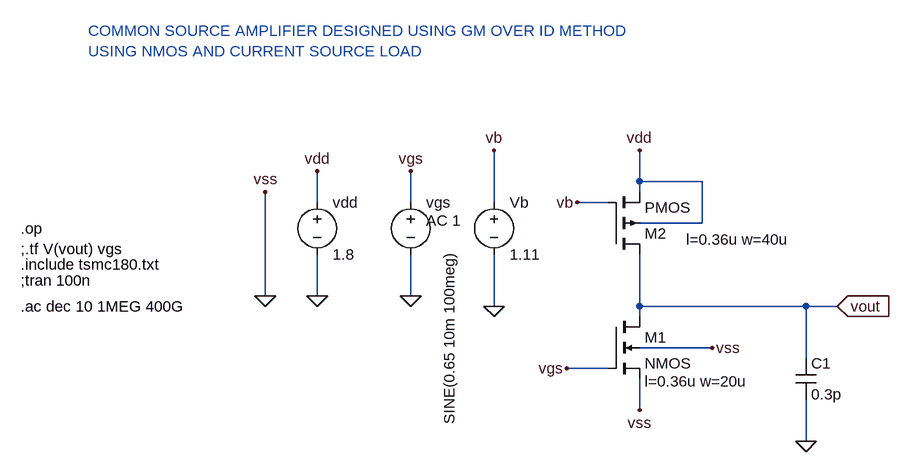
[diagram p0: schematic csampgmid_currentsourceload - Copy.asc]
csampgmid_currentsourceload - Copy.asc, the LTspice schematic file:
Version 4
SHEET 1 880 680
WIRE 368 96 368 48
WIRE 464 96 368 96
WIRE 368 112 368 96
WIRE -128 128 -128 80
WIRE 16 128 16 80
WIRE 144 128 144 48
WIRE 320 128 272 128
WIRE 464 160 464 96
WIRE 464 160 368 160
WIRE -208 272 -208 112
WIRE -128 272 -128 208
WIRE 16 272 16 208
WIRE 144 288 144 208
WIRE 368 288 368 208
WIRE 624 288 368 288
WIRE 672 288 624 288
WIRE 368 304 368 288
WIRE 480 352 368 352
WIRE 624 368 624 288
WIRE 320 384 256 384
WIRE 368 448 368 400
WIRE 624 496 624 432
FLAG 16 272 0
FLAG -128 272 0
FLAG -208 272 0
FLAG -208 112 vss
FLAG -128 80 vdd
FLAG 16 80 vgs
FLAG 368 448 vss
FLAG 480 352 vss
FLAG 256 384 vgs
FLAG 672 288 vout
IOPIN 672 288 In
FLAG 624 496 0
FLAG 368 48 vdd
FLAG 144 288 0
FLAG 144 48 vb
FLAG 272 128 vb
DATAFLAG 368 240 ""
DATAFLAG 368 240 ""
SYMBOL nmos4 320 304 R0
WINDOW 123 56 100 Left 2
SYMATTR Value2 l=0.36u w=20u
SYMATTR InstName M1
SYMBOL voltage 16 112 R0
WINDOW 3 59 90 VRight 2
WINDOW 123 24 44 Left 2
WINDOW 39 0 0 Left 0
SYMATTR Value SINE(0.65 10m 100meg)
SYMATTR Value2 AC 1
SYMATTR InstName vgs
SYMBOL voltage -128 112 R0
WINDOW 123 0 0 Left 0
WINDOW 39 0 0 Left 0
SYMATTR InstName vdd
SYMATTR Value 1.8
SYMBOL cap 608 368 R0
SYMATTR InstName C1
SYMATTR Value 0.3p
SYMBOL pmos4 320 208 M180
WINDOW 123 120 23 Left 2
SYMATTR Value2 l=0.36u w=40u
SYMATTR InstName M2
SYMBOL voltage 144 112 R0
WINDOW 123 0 0 Left 0
WINDOW 39 0 0 Left 0
SYMATTR InstName Vb
SYMATTR Value 1.11
TEXT -584 224 Left 2 !.include tsmc180.txt
TEXT -584 168 Left 2 !.op
TEXT -584 200 Left 2 !;.tf V(vout) vgs
TEXT -584 248 Left 2 !;tran 100n
TEXT -480 -136 Left 2 ;COMMON SOURCE AMPLIFIER DESIGNED USING GM OVER ID METHOD \nUSING NMOS AND CURRENT SOURCE LOAD
TEXT -584 288 Left 2 !.ac dec 10 1MEG 400G

The netlist it stands for:
* csampgmid_currentsourceload - Copy.asc
M1 vout vgs 0 0 NMOS l=0.36u w=20u
vgs vgs 0 SINE(0.65 10m 100meg) AC 1
vdd vdd 0 1.8
C1 vout 0 0.3p
M2 vout vb vdd vdd PMOS l=0.36u w=40u
Vb vb 0 1.11
.model NMOS NMOS
.model PMOS PMOS
.lib standard.mos
.include tsmc180.txt
.op
;.tf V(vout) vgs
;tran 100n
* COMMON SOURCE AMPLIFIER DESIGNED USING GM OVER ID METHOD
* USING NMOS AND CURRENT SOURCE LOAD
.ac dec 10 1MEG 400G
.backanno
.end